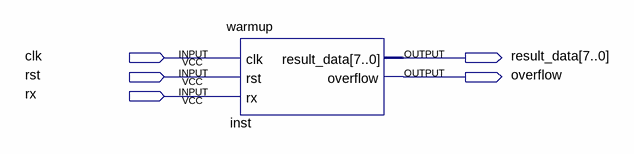
[diagram p0: schematic sheet]
// Quartus schematic Teste.bdf as structural Verilog: 1 symbols, 5 pins
module Teste (
  input  clk,
  input  rst,
  input  rx,
  output [7:0] result_data,
  output overflow
);

  warmup inst (.clk(clk), .rst(rst), .rx(rx), .result_data(result_data), .overflow(overflow));
endmodule
